# Altium schematic sheet Connector-side-3.SchDoc: =ProjectTitle
size 297 x 209 mm; Address1: Address1; Address2: Address2; Address3: Address3; Address4: Address4; SheetNumber: ?; SheetTotal: ?; Scale: 1:1; DocumentType: Схема электрическая принципиальная
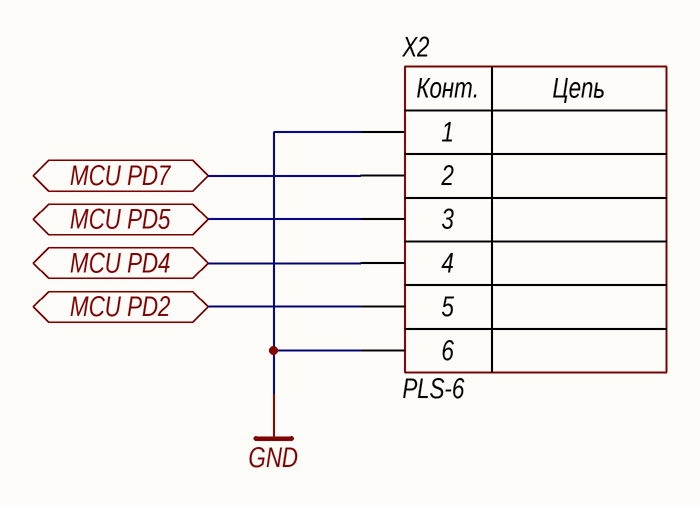
[diagram p0: Connector-side-3.SchDoc]

## Parts
X2  PLS-6  [CON: PLS-6]

## Ports
MCU PD2 (bidir), MCU PD4 (bidir), MCU PD5 (bidir), MCU PD7 (bidir)

## Nets
GND: X2.1 X2.6
MCU PD2: X2.5 ; port MCU PD2
MCU PD4: X2.4 ; port MCU PD4
MCU PD5: X2.3 ; port MCU PD5
MCU PD7: X2.2 ; port MCU PD7

## Notes on the sheet
- Изм.
- Лист
- № докум.
- Подп.
- Дата
- Копировал
- Формат А4
- (in symbol 6-Connector) Конт.; Цепь

## Library data of the parts
X2 = 6-Connector: Model: PLS-6; Manufacturer: *; HelpURL: *; ComponentKind: *